# Altium schematic sheet RX_V1.SchDoc
size A; SheetNumber: 1; SheetTotal: 1
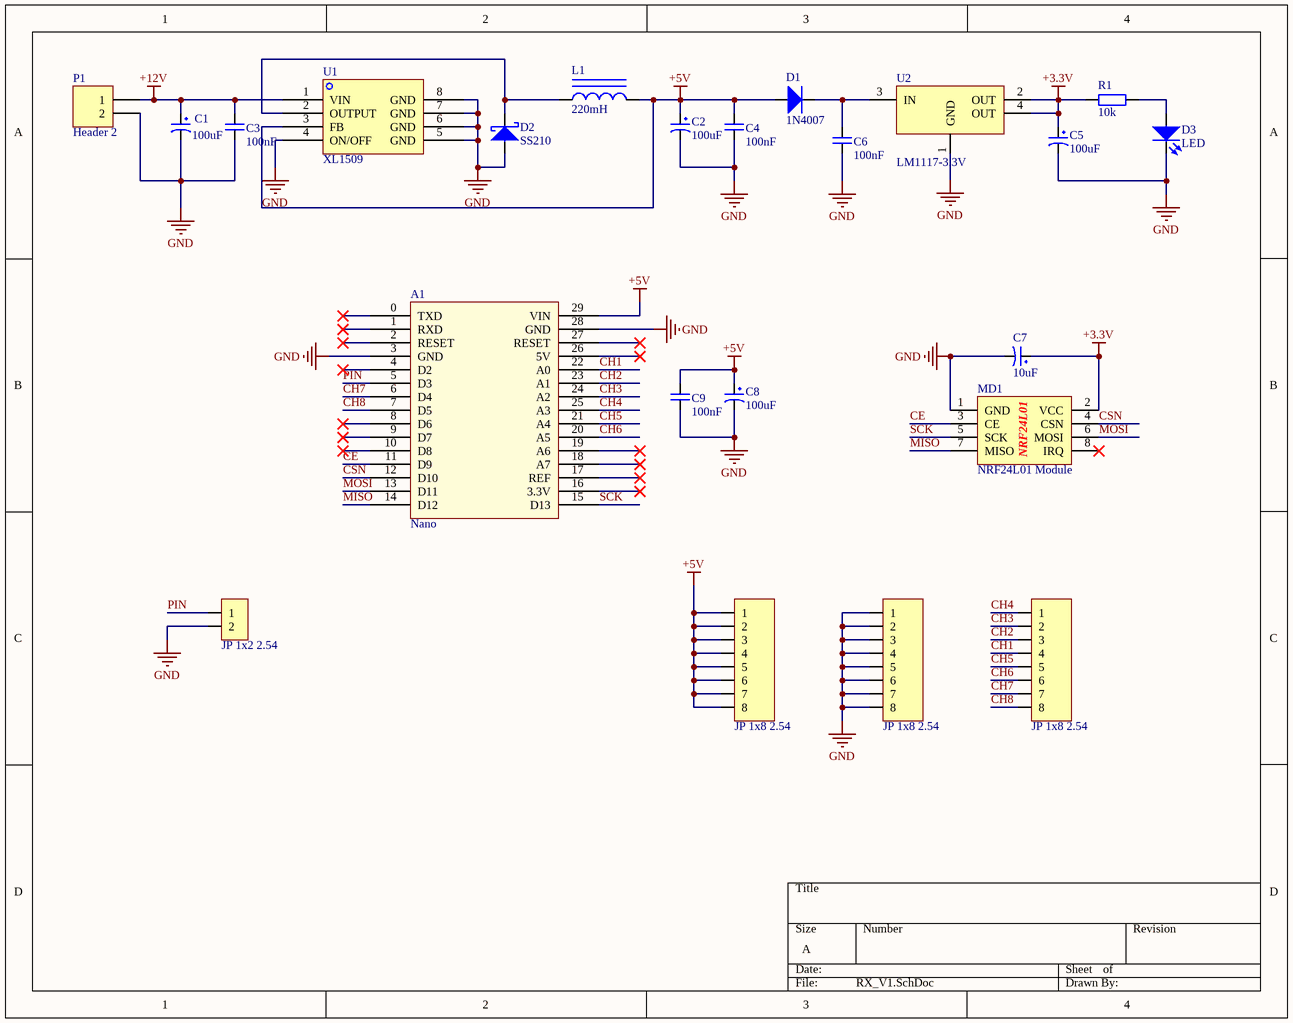
[diagram p0: RX_V1.SchDoc]

## Parts
A1  Nano  [Arduino nano]
C1  100uF  [tu hoa 5mm]
C2  100uF  [tu hoa 5mm]
C3  100nF  [CN1]
C4  100nF  [CN1]
C5  100uF  [tu hoa 5mm]
C6  100nF  [CN1]
C7  10uF  [tu hoa 5mm]
C8  100uF  [tu hoa 5mm]
C9  100nF  [CN1]
D1  1N4007  [DO-201AD-V]
D2  SS210  [DO-214AC]
D3  LED  [LED-3MM RED]
JP1  JP 1x2 2.54  [JP 1x2 DT]
JP2  JP 1x8 2.54  [JP 1x8 DT]
JP3  JP 1x8 2.54  [JP 1x8 DT]
JP4  JP 1x8 2.54  [JP 1x8 DT]
L1  220mH  [INDUCTOR SMD 7342 7.3X7.3X4.2mm]
MD1  NRF24L01 Module  [NRF24L01]
P1  Header 2  [HED2T]
R1  10k  [RESISTOR 1/4W]
U1  XL1509  [SOP8]
U2  LM1117-3.3V  [SOT223-4N]

## Nets
+3.3V: C5.1 C7.1 MD1.2(VCC) R1.1 U2.2(OUT) U2.4(OUT)
+5V: A1.29(VIN) C2.1 C4.2 C8.1 C9.2 D1.1 JP2.1 JP2.2 JP2.3 JP2.4 JP2.5 JP2.6 JP2.7 JP2.8 L1.2 U1.3(FB)
+12V: C1.1 C3.2 P1.1 U1.1(VIN)
GND: A1.3(GND) A1.28(GND) C1.2 C2.2 C3.1 C4.1 C5.2 C6.1 C7.2 C8.2 C9.1 D2.1 D3.2 JP1.2 JP3.1 JP3.2 JP3.3 JP3.4 JP3.5 JP3.6 JP3.7 JP3.8 MD1.1(GND) P1.2 U1.4(ON/OFF) U1.5(GND) U1.6(GND) U1.7(GND) U1.8(GND) U2.1(GND)
CE: A1.11(D9) MD1.3(CE)
CH1: A1.22(A0) JP4.4
CH2: A1.23(A1) JP4.3
CH3: A1.24(A2) JP4.2
CH4: A1.25(A3) JP4.1
CH5: A1.21(A4) JP4.5
CH6: A1.20(A5) JP4.6
CH7: A1.6(D4) JP4.7
CH8: A1.7(D5) JP4.8
CSN: A1.12(D10) MD1.4(CSN)
MISO: A1.14(D12) MD1.7(MISO)
MOSI: A1.13(D11) MD1.6(MOSI)
PIN: A1.5(D3) JP1.1
SCK: A1.15(D13) MD1.5(SCK)
NetC6_2: C6.2 D1.2 U2.3(IN)
NetD2_2: D2.2 L1.1 U1.2(OUTPUT)
NetD3_1: D3.1 R1.2

Not connected (* = marked no-connect by the designer): A1 0(TXD)* 1(RXD)* 2(RESET)* 4(D2)* 8(D6)* 9(D7)* 10(D8)* 16(3.3V)* 17(REF)* 18(A7)* 19(A6)* 26(5V)* 27(RESET)*; MD1 8(IRQ)*

## Notes on the sheet
- (in symbol NRF24L01 Module) NRF24L01

## Library data of the parts
A1 = Arduino Nano
C1 C2 C5 C7 C8 = Tu Hoa 100uF 25V 6x11: Cắm; Don_Vi: Con; So_Chan: 2; Ten_Linh_Kien: Tụ Hóa 100uF 25V 6x11MM; Ma_Hang: MH001351; Chung_Loai: Cắm; Kieu_Chan: *
C3 C4 C6 C9 = Cap_Non-Polar
D1 = Diode Standard: Part Number: LED 3 ly Single Colour; Pricing: *
D2 = Diode Schottky: Part Number: LED 3 ly Single Colour; Pricing: *
D3 = LED: LED Single; Value: LED 3 ly Single Colour
JP1 = JP 1x2 2.54 Duc Thang: Cắm; Ten_Linh_Kien: Jump Đơn Đực 2.54MM 1x40P Thẳng 11MM; Don_Vi: Con; Ma_Hang: MH000903; Ghi_Chu: *; Kieu_Chan: *; Chung_Loai: Cắm
JP2-JP4 = JP 1x8 2.54 Duc Thang: Cắm; Ten_Linh_Kien: Jump Đơn Đực 2.54MM 1x40P Thẳng 11MM; Don_Vi: Con; Ma_Hang: MH000903; Ghi_Chu: *; Kieu_Chan: *; Chung_Loai: Cắm
L1 = Inductor Iron: Magnetic-Core Inductor; Value: 150 mH
P1 = Header 2: Header, 2-Pin; LatestRevisionDate: 17-Jul-2002; LatestRevisionNote: Re-released for DXP Platform.; Publisher: Altium Limited
R1 = Resistor
U1 = XL1509: IC power sop8
U2 = LM1117: 800mA Low-Dropout Linear Regulator; Creator: Nguyen Ba Bien; Website: http://group3i.net